# Altium schematic sheet Microcontroller.SchDoc
size A2
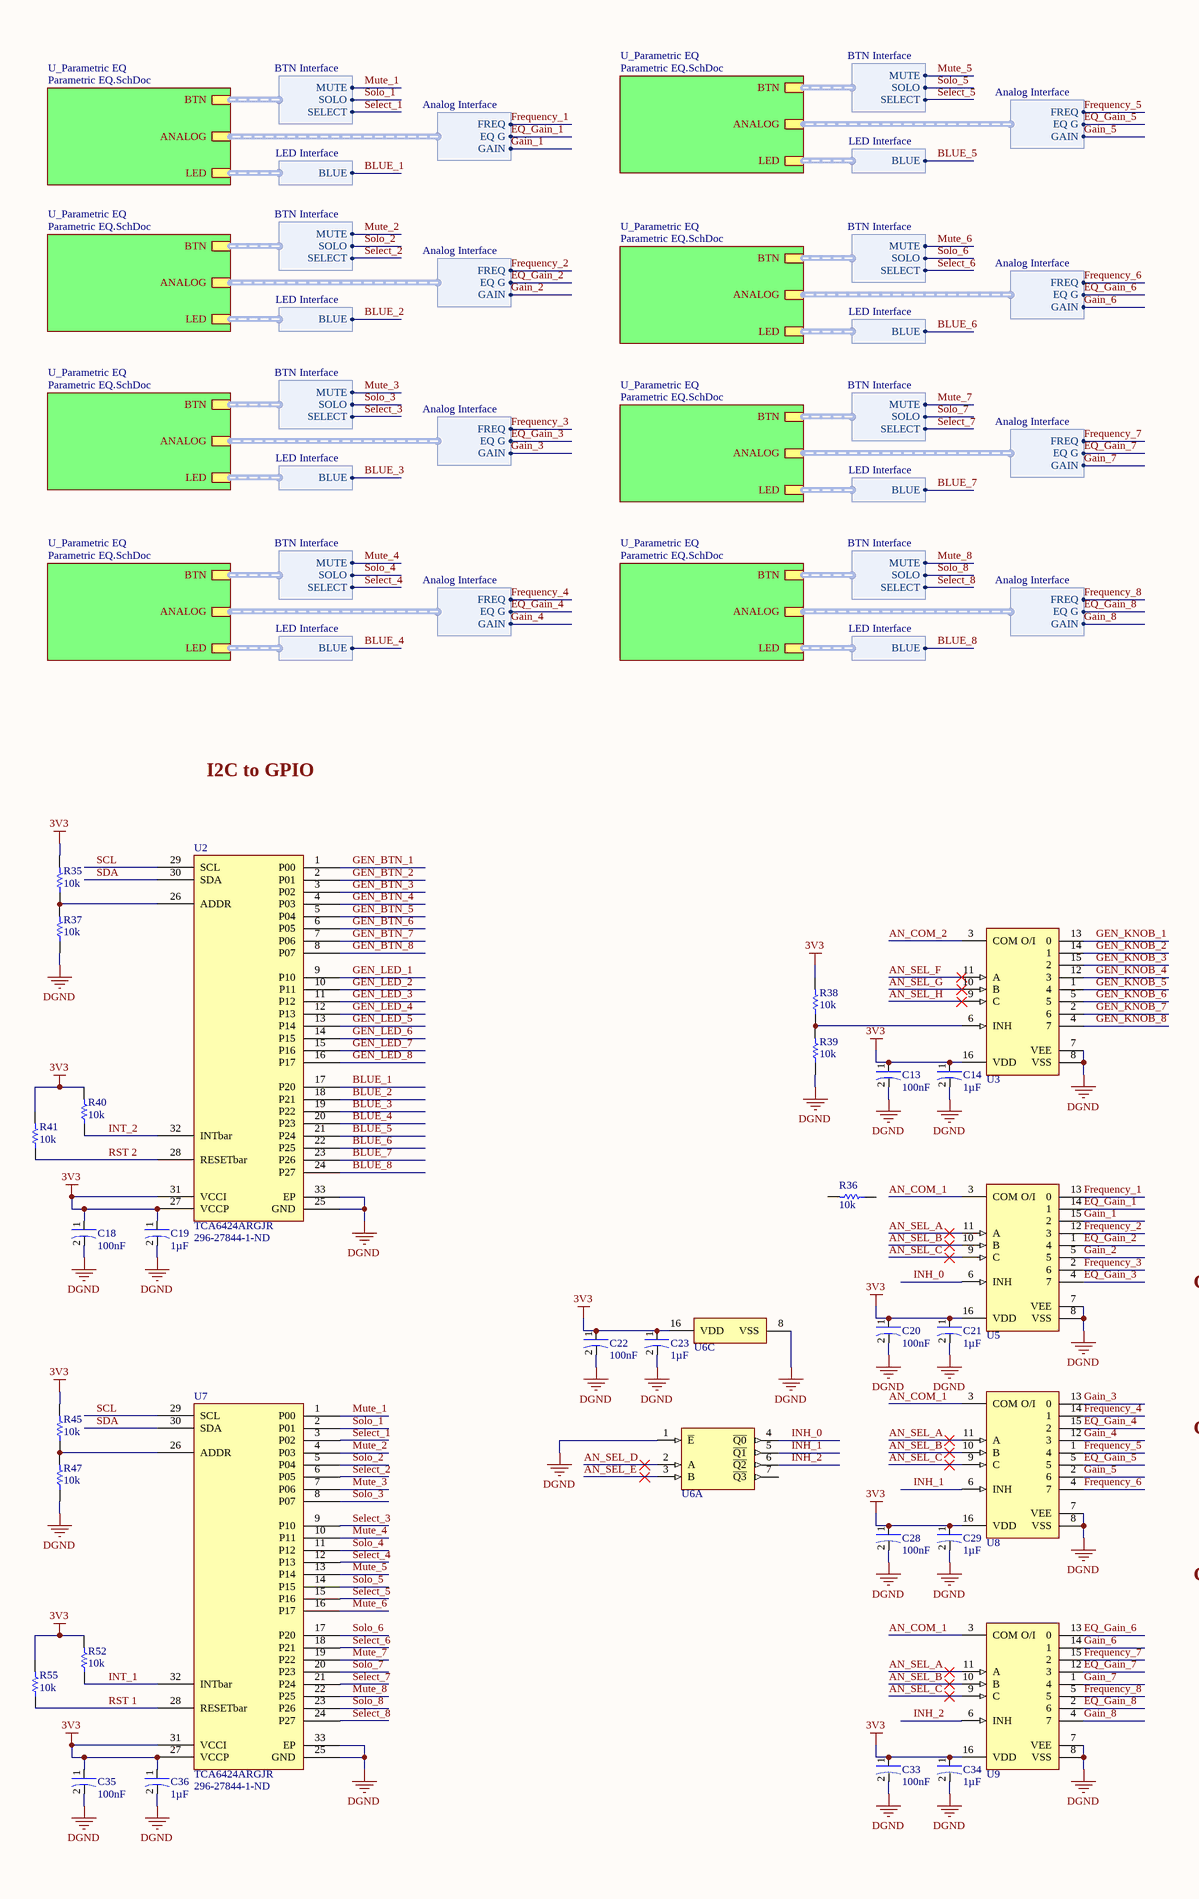
[diagram p0: Microcontroller.SchDoc, left]
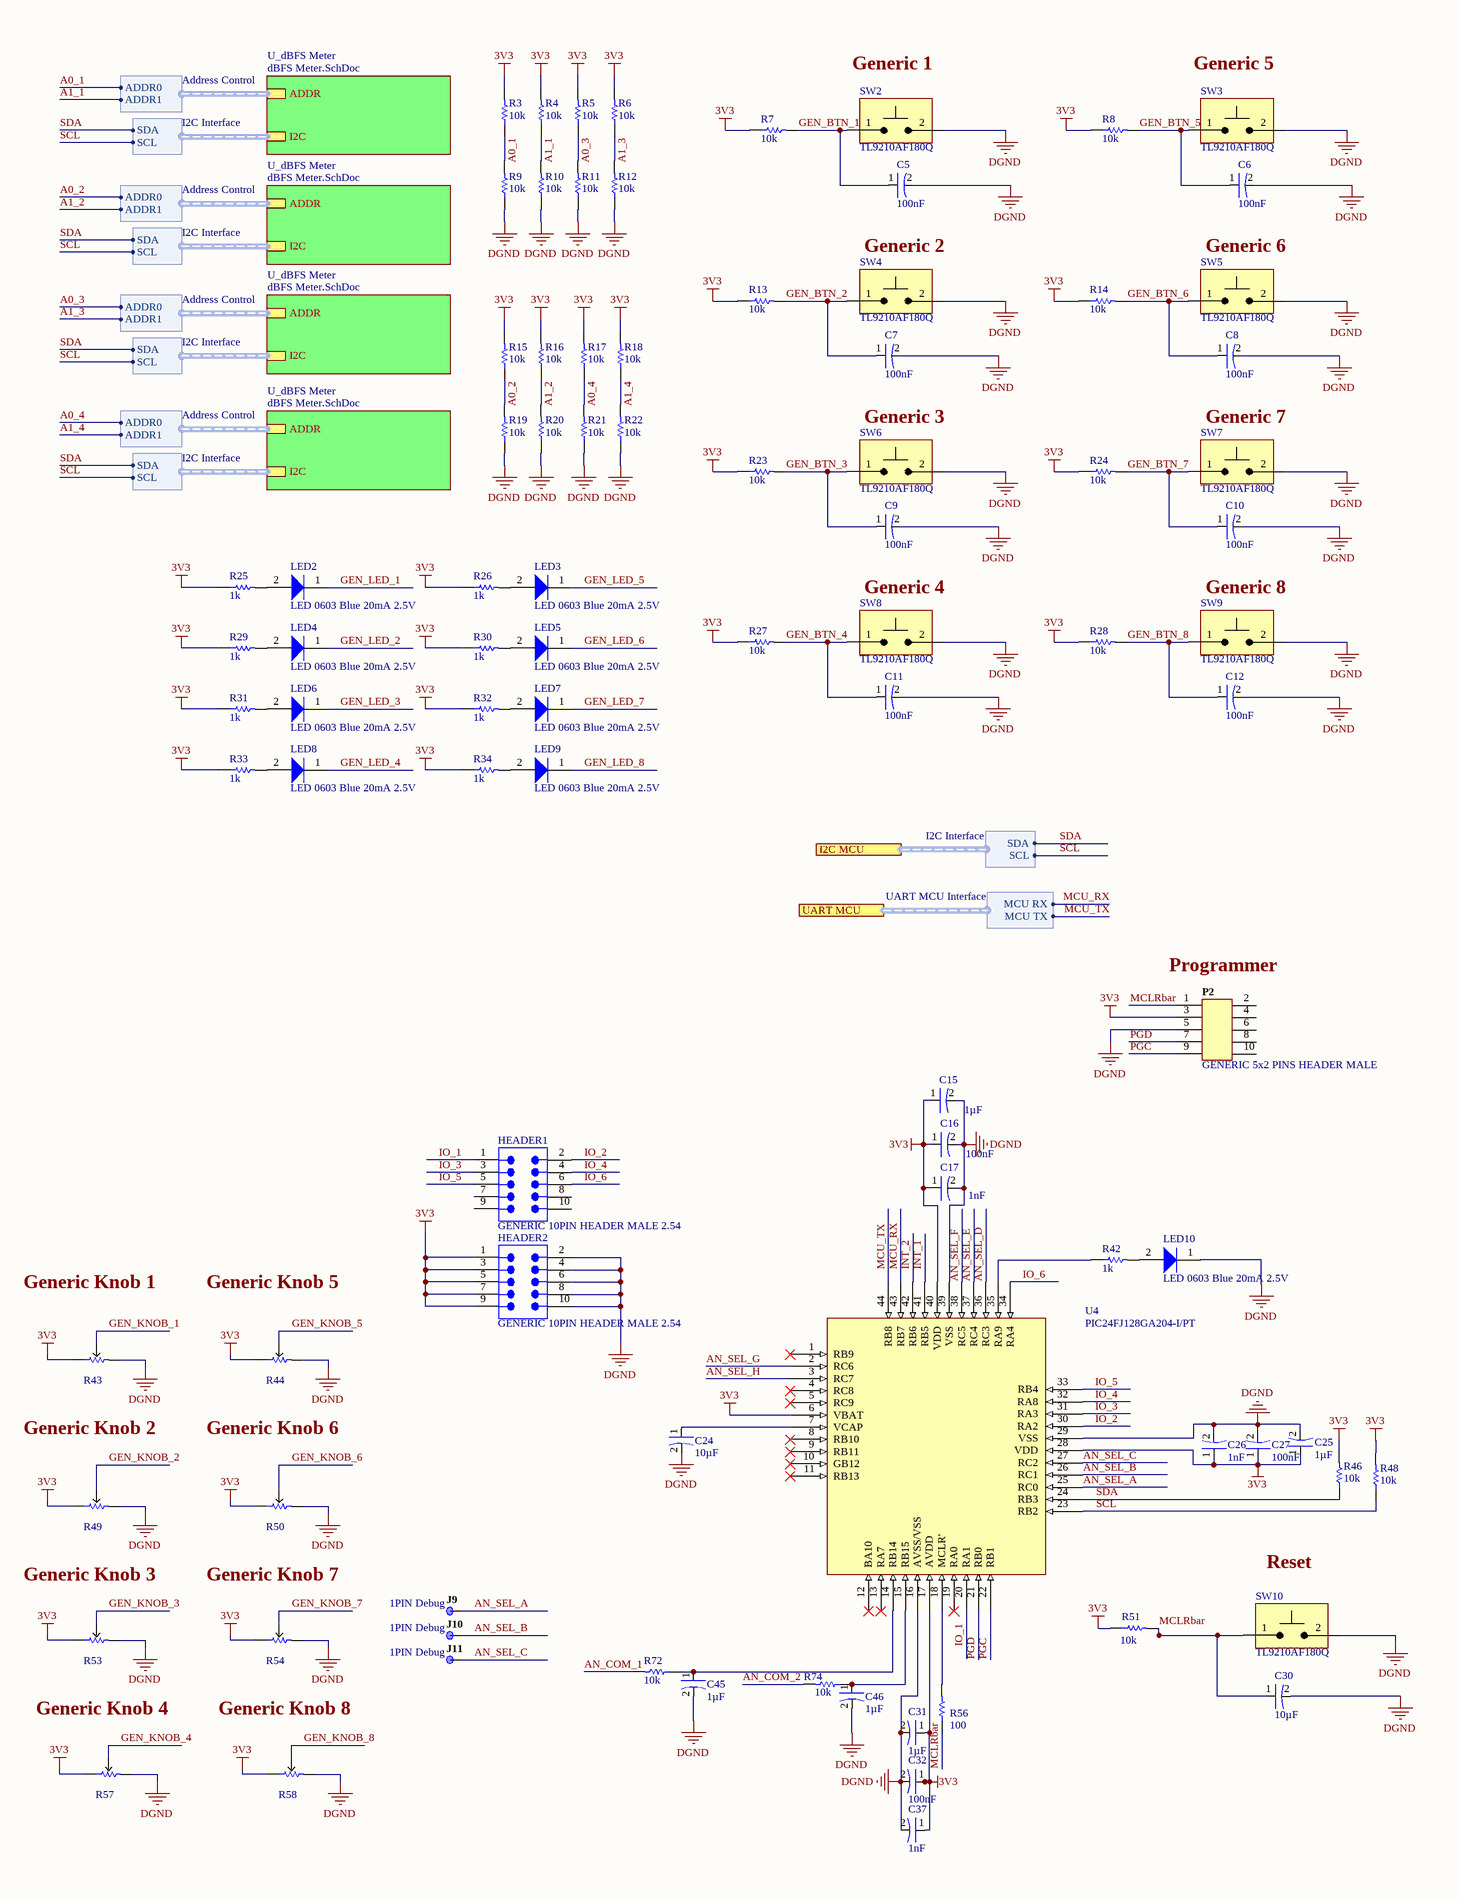
[diagram p1: Microcontroller.SchDoc, right]

## Parts
C5  value 100nF  [0402-M]  (hidden comment: CAP 0.1uF CER 0402 16V X5R 10%)
C6  value 100nF  [0402-M]  (hidden comment: CAP 0.1uF CER 0402 16V X5R 10%)
C7  value 100nF  [0402-M]  (hidden comment: CAP 0.1uF CER 0402 16V X5R 10%)
C8  value 100nF  [0402-M]  (hidden comment: CAP 0.1uF CER 0402 16V X5R 10%)
C9  value 100nF  [0402-M]  (hidden comment: CAP 0.1uF CER 0402 16V X5R 10%)
C10  value 100nF  [0402-M]  (hidden comment: CAP 0.1uF CER 0402 16V X5R 10%)
C11  value 100nF  [0402-M]  (hidden comment: CAP 0.1uF CER 0402 16V X5R 10%)
C12  value 100nF  [0402-M]  (hidden comment: CAP 0.1uF CER 0402 16V X5R 10%)
C13  value 100nF  [0805-M]  (hidden comment: CAP 0.1uF CER 0805 50V  X7R 5%)
C14  value 1µF  [0805-M]  (hidden comment: CAP 1uF CER 0805 25V C0G 10%)
C15  value 1µF  [0805-M]  (hidden comment: CAP 1uF CER 0805 25V C0G 10%)
C16  value 100nF  [0805-M]  (hidden comment: CAP 0.1uF CER 0805 50V  X7R 5%)
C17  value 1nF  [0805-M]  (hidden comment: CAP 1nF CER 0805 25V X7R 5%)
C18  value 100nF  [0805-M]  (hidden comment: CAP 0.1uF CER 0805 50V  X7R 5%)
C19  value 1µF  [0805-M]  (hidden comment: CAP 1uF CER 0805 25V C0G 10%)
C20  value 100nF  [0805-M]  (hidden comment: CAP 0.1uF CER 0805 50V  X7R 5%)
C21  value 1µF  [0805-M]  (hidden comment: CAP 1uF CER 0805 25V C0G 10%)
C22  value 100nF  [0805-M]  (hidden comment: CAP 0.1uF CER 0805 50V  X7R 5%)
C23  value 1µF  [0805-M]  (hidden comment: CAP 1uF CER 0805 25V C0G 10%)
C24  value 10µF  [0805-M]  (hidden comment: CAP 10uF CER 0805 25V X5R 10%)
C25  value 1µF  [0805-M]  (hidden comment: CAP 1uF CER 0805 25V C0G 10%)
C26  value 1nF  [0805-M]  (hidden comment: CAP 1nF CER 0805 25V X7R 5%)
C27  value 100nF  [0805-M]  (hidden comment: CAP 0.1uF CER 0805 50V  X7R 5%)
C28  value 100nF  [0805-M]  (hidden comment: CAP 0.1uF CER 0805 50V  X7R 5%)
C29  value 1µF  [0805-M]  (hidden comment: CAP 1uF CER 0805 25V C0G 10%)
C30  value 10µF  [0402-M]  (hidden comment: CAP 10uF CER 0402 6.3V X5R 20%)
C31  value 1µF  [0805-M]  (hidden comment: CAP 1uF CER 0805 25V C0G 10%)
C32  value 100nF  [0805-M]  (hidden comment: CAP 0.1uF CER 0805 50V  X7R 5%)
C33  value 100nF  [0805-M]  (hidden comment: CAP 0.1uF CER 0805 50V  X7R 5%)
C34  value 1µF  [0805-M]  (hidden comment: CAP 1uF CER 0805 25V C0G 10%)
C35  value 100nF  [0805-M]  (hidden comment: CAP 0.1uF CER 0805 50V  X7R 5%)
C36  value 1µF  [0805-M]  (hidden comment: CAP 1uF CER 0805 25V C0G 10%)
C37  value 1nF  [0805-M]  (hidden comment: CAP 1nF CER 0805 25V X7R 5%)
C45  value 1µF  [0402-M]  (hidden comment: CAP 1uF CER 0402 6.3V X5R 10%)
C46  value 1µF  [0402-M]  (hidden comment: CAP 1uF CER 0402 6.3V X5R 10%)
HEADER1  GENERIC 10PIN HEADER MALE 2.54  [GENERIC 10Pin Header Male 2.54mm]
HEADER2  GENERIC 10PIN HEADER MALE 2.54  [GENERIC 10Pin Header Male 2.54mm]
J9  1PIN Debug  [1 Pin Debug Port 0.9mm]
J10  1PIN Debug  [1 Pin Debug Port 0.9mm]
J11  1PIN Debug  [1 Pin Debug Port 0.9mm]
LED2  LED 0603 Blue 20mA 2.5V  [VAOL-S6SB4]
LED3  LED 0603 Blue 20mA 2.5V  [VAOL-S6SB4]
LED4  LED 0603 Blue 20mA 2.5V  [VAOL-S6SB4]
LED5  LED 0603 Blue 20mA 2.5V  [VAOL-S6SB4]
LED6  LED 0603 Blue 20mA 2.5V  [VAOL-S6SB4]
LED7  LED 0603 Blue 20mA 2.5V  [VAOL-S6SB4]
LED8  LED 0603 Blue 20mA 2.5V  [VAOL-S6SB4]
LED9  LED 0603 Blue 20mA 2.5V  [VAOL-S6SB4]
LED10  LED 0603 Blue 20mA 2.5V  [VAOL-S6SB4]
P2  GENERIC 5x2 PINS HEADER MALE  [GENERIC 5PIN 2ROW HEADER 0]
R3  value 10k  [0402-M]  (hidden comment: RES 10k 0402 63mW 5%)
R4  value 10k  [0402-M]  (hidden comment: RES 10k 0402 63mW 5%)
R5  value 10k  [0402-M]  (hidden comment: RES 10k 0402 63mW 5%)
R6  value 10k  [0402-M]  (hidden comment: RES 10k 0402 63mW 5%)
R7  value 10k  [0402-M]  (hidden comment: RES 10k 0402 63mW 5%)
R8  value 10k  [0402-M]  (hidden comment: RES 10k 0402 63mW 5%)
R9  value 10k  [0402-M]  (hidden comment: RES 10k 0402 63mW 5%)
R10  value 10k  [0402-M]  (hidden comment: RES 10k 0402 63mW 5%)
R11  value 10k  [0402-M]  (hidden comment: RES 10k 0402 63mW 5%)
R12  value 10k  [0402-M]  (hidden comment: RES 10k 0402 63mW 5%)
R13  value 10k  [0402-M]  (hidden comment: RES 10k 0402 63mW 5%)
R14  value 10k  [0402-M]  (hidden comment: RES 10k 0402 63mW 5%)
R15  value 10k  [0402-M]  (hidden comment: RES 10k 0402 63mW 5%)
R16  value 10k  [0402-M]  (hidden comment: RES 10k 0402 63mW 5%)
R17  value 10k  [0402-M]  (hidden comment: RES 10k 0402 63mW 5%)
R18  value 10k  [0402-M]  (hidden comment: RES 10k 0402 63mW 5%)
R19  value 10k  [0402-M]  (hidden comment: RES 10k 0402 63mW 5%)
R20  value 10k  [0402-M]  (hidden comment: RES 10k 0402 63mW 5%)
R21  value 10k  [0402-M]  (hidden comment: RES 10k 0402 63mW 5%)
R22  value 10k  [0402-M]  (hidden comment: RES 10k 0402 63mW 5%)
R23  value 10k  [0402-M]  (hidden comment: RES 10k 0402 63mW 5%)
R24  value 10k  [0402-M]  (hidden comment: RES 10k 0402 63mW 5%)
R25  value 1k  [0402-M]  (hidden comment: RES 1k 0402 63mW 1%)
R26  value 1k  [0402-M]  (hidden comment: RES 1k 0402 63mW 1%)
R27  value 10k  [0402-M]  (hidden comment: RES 10k 0402 63mW 5%)
R28  value 10k  [0402-M]  (hidden comment: RES 10k 0402 63mW 5%)
R29  value 1k  [0402-M]  (hidden comment: RES 1k 0402 63mW 1%)
R30  value 1k  [0402-M]  (hidden comment: RES 1k 0402 63mW 1%)
R31  value 1k  [0402-M]  (hidden comment: RES 1k 0402 63mW 1%)
R32  value 1k  [0402-M]  (hidden comment: RES 1k 0402 63mW 1%)
R33  value 1k  [0402-M]  (hidden comment: RES 1k 0402 63mW 1%)
R34  value 1k  [0402-M]  (hidden comment: RES 1k 0402 63mW 1%)
R35  value 10k  [0805-M]  (hidden comment: RES 10k 0805 125mW 1%)
R36  value 10k  [0402-M]  (hidden comment: RES 10k 0402 63mW 5%)
R37  value 10k  [0805-M]  (hidden comment: RES 10k 0805 125mW 1%)
R38  value 10k  [0805-M]  (hidden comment: RES 10k 0805 125mW 1%)
R39  value 10k  [0805-M]  (hidden comment: RES 10k 0805 125mW 1%)
R40  value 10k  [0805-M]  (hidden comment: RES 10k 0805 125mW 1%)
R41  value 10k  [0805-M]  (hidden comment: RES 10k 0805 125mW 1%)
R42  value 1k  [0402-M]  (hidden comment: RES 1k 0402 63mW 1%)
R43  P120PK-Y25BR10K  [P120PK-Y25BR10K-Footprint-1]  (value not drawn)
R44  P120PK-Y25BR10K  [P120PK-Y25BR10K-Footprint-1]  (value not drawn)
R45  value 10k  [0805-M]  (hidden comment: RES 10k 0805 125mW 1%)
R46  value 10k  [0805-M]  (hidden comment: RES 10k 0805 125mW 1%)
R47  value 10k  [0805-M]  (hidden comment: RES 10k 0805 125mW 1%)
R48  value 10k  [0805-M]  (hidden comment: RES 10k 0805 125mW 1%)
R49  P120PK-Y25BR10K  [P120PK-Y25BR10K-Footprint-1]  (value not drawn)
R50  P120PK-Y25BR10K  [P120PK-Y25BR10K-Footprint-1]  (value not drawn)
R51  value 10k  [0402-M]  (hidden comment: RES 10k 0402 63mW 5%)
R52  value 10k  [0805-M]  (hidden comment: RES 10k 0805 125mW 1%)
R53  P120PK-Y25BR10K  [P120PK-Y25BR10K-Footprint-1]  (value not drawn)
R54  P120PK-Y25BR10K  [P120PK-Y25BR10K-Footprint-1]  (value not drawn)
R55  value 10k  [0805-M]  (hidden comment: RES 10k 0805 125mW 1%)
R56  value 100  [0805-L]  (hidden comment: RES 100 0805 125mW 1%)
R57  P120PK-Y25BR10K  [P120PK-Y25BR10K-Footprint-1]  (value not drawn)
R58  P120PK-Y25BR10K  [P120PK-Y25BR10K-Footprint-1]  (value not drawn)
R72  value 10k  [0402-M]  (hidden comment: RES 10k 0402 63mW 5%)
R74  value 10k  [0402-M]  (hidden comment: RES 10k 0402 63mW 5%)
SW2  TL9210AF180Q  [TL9210]
SW3  TL9210AF180Q  [TL9210]
SW4  TL9210AF180Q  [TL9210]
SW5  TL9210AF180Q  [TL9210]
SW6  TL9210AF180Q  [TL9210]
SW7  TL9210AF180Q  [TL9210]
SW8  TL9210AF180Q  [TL9210]
SW9  TL9210AF180Q  [TL9210]
SW10  TL9210AF180Q  [TL9210]
U2  TCA6424ARGJR  Supplier Part Number 1: 296-27844-1-ND  [TCA6424ARGJR]
U3  CD4051BM  [D0016A_M]  (value not drawn)
U4  PIC24FJ128GA204-I/PT  [CQFP80P1415X1415X120-44N]
U5  CD4051BM  [D0016A_M]  (value not drawn)
U6  CD4556BM96  [D0016A_M]  (value not drawn)  (parts A,C of 3)
U7  TCA6424ARGJR  Supplier Part Number 1: 296-27844-1-ND  [TCA6424ARGJR]
U8  CD4051BM  [D0016A_M]  (value not drawn)
U9  CD4051BM  [D0016A_M]  (value not drawn)

## Sub-sheets
U_dBFS Meter = dBFS Meter.SchDoc: ADDR (harness Address Control), I2C (harness I2C Interface)
U_dBFS Meter = dBFS Meter.SchDoc: ADDR (harness Address Control), I2C (harness I2C Interface)
U_dBFS Meter = dBFS Meter.SchDoc: ADDR (harness Address Control), I2C (harness I2C Interface)
U_dBFS Meter = dBFS Meter.SchDoc: ADDR (harness Address Control), I2C (harness I2C Interface)
U_Parametric EQ = Parametric EQ.SchDoc: BTN (harness BTN Interface), ANALOG (harness Analog Interface), LED (harness LED Interface)
U_Parametric EQ = Parametric EQ.SchDoc: BTN (harness BTN Interface), ANALOG (harness Analog Interface), LED (harness LED Interface)
U_Parametric EQ = Parametric EQ.SchDoc: BTN (harness BTN Interface), ANALOG (harness Analog Interface), LED (harness LED Interface)
U_Parametric EQ = Parametric EQ.SchDoc: BTN (harness BTN Interface), ANALOG (harness Analog Interface), LED (harness LED Interface)
U_Parametric EQ = Parametric EQ.SchDoc: BTN (harness BTN Interface), ANALOG (harness Analog Interface), LED (harness LED Interface)
U_Parametric EQ = Parametric EQ.SchDoc: BTN (harness BTN Interface), ANALOG (harness Analog Interface), LED (harness LED Interface)
U_Parametric EQ = Parametric EQ.SchDoc: BTN (harness BTN Interface), ANALOG (harness Analog Interface), LED (harness LED Interface)
U_Parametric EQ = Parametric EQ.SchDoc: BTN (harness BTN Interface), ANALOG (harness Analog Interface), LED (harness LED Interface)

## Ports
I2C MCU (harness I2C Interface), UART MCU (harness UART MCU Interface)

## Harnesses
UART MCU Interface: MCU RX, MCU TX
BTN Interface: MUTE, SOLO, SELECT
Analog Interface: FREQ, EQ G, GAIN
I2C Interface: SDA, SCL
Address Control: ADDR0, ADDR1
LED Interface: BLUE

## Nets
3V3: C13.1(Anode) C14.1(Anode) C15.1(Anode) C16.1(Anode) C17.1(Anode) C18.1(Anode) C19.1(Anode) C20.1(Anode) C21.1(Anode) C22.1(Anode) C23.1(Anode) C25.1(Anode) C26.1(Anode) C27.1(Anode) C28.1(Anode) C29.1(Anode) C31.1(Anode) C32.1(Anode) C33.1(Anode) C34.1(Anode) C35.1(Anode) C36.1(Anode) C37.1(Anode) HEADER2.1 HEADER2.3 HEADER2.5 HEADER2.7 HEADER2.9 P2.3 R3.2 R4.2 R5.2 R6.2 R7.1 R8.1 R13.1 R14.1 R15.2 R16.2 R17.2 R18.2 R23.1 R24.1 R25.1 R26.1 R27.1 R28.1 R29.1 R30.1 R31.1 R32.1 R33.1 R34.1 R35.2 R38.2 R40.2 R41.2 R43.1 R44.1 R45.2 R46.2 R48.2 R49.1 R50.1 R51.1 R52.2 R53.1 R54.1 R55.2 R57.1 R58.1 U2.27(VCCP) U2.31(VCCI) U3.16(VDD) U4.6(VBAT) U4.17(AVDD) U4.28(VDD) U4.40(VDD) U5.16(VDD) U6.16(VDD) U7.27(VCCP) U7.31(VCCI) U8.16(VDD) U9.16(VDD)
DGND: C5.2(Cathode) C6.2(Cathode) C7.2(Cathode) C8.2(Cathode) C9.2(Cathode) C10.2(Cathode) C11.2(Cathode) C12.2(Cathode) C13.2(Cathode) C14.2(Cathode) C15.2(Cathode) C16.2(Cathode) C17.2(Cathode) C18.2(Cathode) C19.2(Cathode) C20.2(Cathode) C21.2(Cathode) C22.2(Cathode) C23.2(Cathode) C24.2(Cathode) C25.2(Cathode) C26.2(Cathode) C27.2(Cathode) C28.2(Cathode) C29.2(Cathode) C30.2(Cathode) C31.2(Cathode) C32.2(Cathode) C33.2(Cathode) C34.2(Cathode) C35.2(Cathode) C36.2(Cathode) C37.2(Cathode) C45.2(Cathode) C46.2(Cathode) HEADER2.2 HEADER2.4 HEADER2.6 HEADER2.8 HEADER2.10 LED10.1 P2.5 R9.1 R10.1 R11.1 R12.1 R19.1 R20.1 R21.1 R22.1 R37.1 R39.1 R43.3 R44.3 R47.1 R49.3 R50.3 R53.3 R54.3 R57.3 R58.3 SW2.2 SW3.2 SW4.2 SW5.2 SW6.2 SW7.2 SW8.2 SW9.2 SW10.2 U2.25(GND) U2.33(EP) U3.7(VEE) U3.8(VSS) U4.16(AVSS/VSS) U4.29(VSS) U4.39(VSS) U5.7(VEE) U5.8(VSS) U6.1(~{E}) U6.8(VSS) U7.25(GND) U7.33(EP) U8.7(VEE) U8.8(VSS) U9.7(VEE) U9.8(VSS)
A0_1: R3.1 R9.2 ; sheet U_dBFS Meter/ADDR.ADDR0
A0_2: R15.1 R19.2 ; sheet U_dBFS Meter/ADDR.ADDR0
A0_3: R5.1 R11.2 ; sheet U_dBFS Meter/ADDR.ADDR0
A0_4: R17.1 R21.2 ; sheet U_dBFS Meter/ADDR.ADDR0
A1_1: R4.1 R10.2 ; sheet U_dBFS Meter/ADDR.ADDR1
A1_2: R16.1 R20.2 ; sheet U_dBFS Meter/ADDR.ADDR1
A1_3: R6.1 R12.2 ; sheet U_dBFS Meter/ADDR.ADDR1
A1_4: R18.1 R22.2 ; sheet U_dBFS Meter/ADDR.ADDR1
AN_COM_1: R72.2 U5.3(COM_O/I) U8.3(COM_O/I) U9.3(COM_O/I)
AN_COM_2: R74.2 U3.3(COM_O/I)
AN_SEL_A: J9.1 U4.25(RC0) U5.11(A) U8.11(A) U9.11(A)
AN_SEL_B: J10.1 U4.26(RC1) U5.10(B) U8.10(B) U9.10(B)
AN_SEL_C: J11.1 U4.27(RC2) U5.9(C) U8.9(C) U9.9(C)
AN_SEL_D: U4.36(RC3) U6.2(A)
AN_SEL_E: U4.37(RC4) U6.3(B)
AN_SEL_F: U3.11(A) U4.38(RC5)
AN_SEL_G: U3.10(B) U4.2(RC6)
AN_SEL_H: U3.9(C) U4.3(RC7)
BLUE_1: U2.17(P20) ; sheet U_Parametric EQ/LED.BLUE
BLUE_2: U2.18(P21) ; sheet U_Parametric EQ/LED.BLUE
BLUE_3: U2.19(P22) ; sheet U_Parametric EQ/LED.BLUE
BLUE_4: U2.20(P23) ; sheet U_Parametric EQ/LED.BLUE
BLUE_5: U2.21(P24) ; sheet U_Parametric EQ/LED.BLUE
BLUE_6: U2.22(P25) ; sheet U_Parametric EQ/LED.BLUE
BLUE_7: U2.23(P26) ; sheet U_Parametric EQ/LED.BLUE
BLUE_8: U2.24(P27) ; sheet U_Parametric EQ/LED.BLUE
EQ_Gain_1: U5.14(1) ; sheet U_Parametric EQ/ANALOG.EQ G
EQ_Gain_2: U5.1(4) ; sheet U_Parametric EQ/ANALOG.EQ G
EQ_Gain_3: U5.4(7) ; sheet U_Parametric EQ/ANALOG.EQ G
EQ_Gain_4: U8.15(2) ; sheet U_Parametric EQ/ANALOG.EQ G
EQ_Gain_5: U8.5 ; sheet U_Parametric EQ/ANALOG.EQ G
EQ_Gain_6: U9.13(0) ; sheet U_Parametric EQ/ANALOG.EQ G
EQ_Gain_7: U9.12(3) ; sheet U_Parametric EQ/ANALOG.EQ G
EQ_Gain_8: U9.2(6) ; sheet U_Parametric EQ/ANALOG.EQ G
Frequency_1: U5.13(0) ; sheet U_Parametric EQ/ANALOG.FREQ
Frequency_2: U5.12(3) ; sheet U_Parametric EQ/ANALOG.FREQ
Frequency_3: U5.2(6) ; sheet U_Parametric EQ/ANALOG.FREQ
Frequency_4: U8.14(1) ; sheet U_Parametric EQ/ANALOG.FREQ
Frequency_5: U8.1(4) ; sheet U_Parametric EQ/ANALOG.FREQ
Frequency_6: U8.4(7) ; sheet U_Parametric EQ/ANALOG.FREQ
Frequency_7: U9.15(2) ; sheet U_Parametric EQ/ANALOG.FREQ
Frequency_8: U9.5 ; sheet U_Parametric EQ/ANALOG.FREQ
Gain_1: U5.15(2) ; sheet U_Parametric EQ/ANALOG.GAIN
Gain_2: U5.5 ; sheet U_Parametric EQ/ANALOG.GAIN
Gain_3: U8.13(0) ; sheet U_Parametric EQ/ANALOG.GAIN
Gain_4: U8.12(3) ; sheet U_Parametric EQ/ANALOG.GAIN
Gain_5: U8.2(6) ; sheet U_Parametric EQ/ANALOG.GAIN
Gain_6: U9.14(1) ; sheet U_Parametric EQ/ANALOG.GAIN
Gain_7: U9.1(4) ; sheet U_Parametric EQ/ANALOG.GAIN
Gain_8: U9.4(7) ; sheet U_Parametric EQ/ANALOG.GAIN
GEN_BTN_1: C5.1(Anode) R7.2 SW2.1 U2.1(P00)
GEN_BTN_2: C7.1(Anode) R13.2 SW4.1 U2.2(P01)
GEN_BTN_3: C9.1(Anode) R23.2 SW6.1 U2.3(P02)
GEN_BTN_4: C11.1(Anode) R27.2 SW8.1 U2.4(P03)
GEN_BTN_5: C6.1(Anode) R8.2 SW3.1 U2.5(P04)
GEN_BTN_6: C8.1(Anode) R14.2 SW5.1 U2.6(P05)
GEN_BTN_7: C10.1(Anode) R24.2 SW7.1 U2.7(P06)
GEN_BTN_8: C12.1(Anode) R28.2 SW9.1 U2.8(P07)
GEN_KNOB_1: R43.2 U3.13(0)
GEN_KNOB_2: R49.2 U3.14(1)
GEN_KNOB_3: R53.2 U3.15(2)
GEN_KNOB_4: R57.2 U3.12(3)
GEN_KNOB_5: R44.2 U3.1(4)
GEN_KNOB_6: R50.2 U3.5
GEN_KNOB_7: R54.2 U3.2(6)
GEN_KNOB_8: R58.2 U3.4(7)
GEN_LED_1: LED2.1 U2.9(P10)
GEN_LED_2: LED4.1 U2.10(P11)
GEN_LED_3: LED6.1 U2.11(P12)
GEN_LED_4: LED8.1 U2.12(P13)
GEN_LED_5: LED3.1 U2.13(P14)
GEN_LED_6: LED5.1 U2.14(P15)
GEN_LED_7: LED7.1 U2.15(P16)
GEN_LED_8: LED9.1 U2.16(P17)
INH_0: U5.6(INH) U6.4(~{Q0})
INH_1: U6.5(~{Q1}) U8.6(INH)
INH_2: U6.6(~{Q2}) U9.6(INH)
INT_1: R52.1 U4.41(RB5) U7.32(INTbar)
INT_2: R40.1 U2.32(INTbar) U4.42(RB6)
IO_1: HEADER1.1 U4.20(RA1)
IO_2: HEADER1.2 U4.30(RA2)
IO_3: HEADER1.3 U4.31(RA3)
IO_4: HEADER1.4 U4.32(RA8)
IO_5: HEADER1.5 U4.33(RB4)
IO_6: HEADER1.6 U4.34(RA4)
MCLRbar: C30.1(Anode) P2.1 R51.2 R56.1 SW10.1
MCU_RX: U4.43(RB7) ; port UART MCU.MCU RX
MCU_TX: U4.44(RB8) ; port UART MCU.MCU TX
Mute_1: U7.1(P00) ; sheet U_Parametric EQ/BTN.MUTE
Mute_2: U7.4(P03) ; sheet U_Parametric EQ/BTN.MUTE
Mute_3: U7.7(P06) ; sheet U_Parametric EQ/BTN.MUTE
Mute_4: U7.10(P11) ; sheet U_Parametric EQ/BTN.MUTE
Mute_5: U7.13(P14) ; sheet U_Parametric EQ/BTN.MUTE
Mute_6: U7.16(P17) ; sheet U_Parametric EQ/BTN.MUTE
Mute_7: U7.19(P22) ; sheet U_Parametric EQ/BTN.MUTE
Mute_8: U7.22(P25) ; sheet U_Parametric EQ/BTN.MUTE
PGC: P2.9 U4.22(RB1)
PGD: P2.7 U4.21(RB0)
RST 1: R55.1 U7.28(RESETbar)
RST 2: R41.1 U2.28(RESETbar)
SCL: R48.1 U2.29(SCL) U4.23(RB2) U7.29(SCL) ; sheet U_dBFS Meter/I2C.SCL, port I2C MCU.SCL
SDA: R46.1 U2.30(SDA) U4.24(RB3) U7.30(SDA) ; sheet U_dBFS Meter/I2C.SDA, port I2C MCU.SDA
Select_1: U7.3(P02) ; sheet U_Parametric EQ/BTN.SELECT
Select_2: U7.6(P05) ; sheet U_Parametric EQ/BTN.SELECT
Select_3: U7.9(P10) ; sheet U_Parametric EQ/BTN.SELECT
Select_4: U7.12(P13) ; sheet U_Parametric EQ/BTN.SELECT
Select_5: U7.15(P16) ; sheet U_Parametric EQ/BTN.SELECT
Select_6: U7.18(P21) ; sheet U_Parametric EQ/BTN.SELECT
Select_7: U7.21(P24) ; sheet U_Parametric EQ/BTN.SELECT
Select_8: U7.24(P27) ; sheet U_Parametric EQ/BTN.SELECT
Solo_1: U7.2(P01) ; sheet U_Parametric EQ/BTN.SOLO
Solo_2: U7.5(P04) ; sheet U_Parametric EQ/BTN.SOLO
Solo_3: U7.8(P07) ; sheet U_Parametric EQ/BTN.SOLO
Solo_4: U7.11(P12) ; sheet U_Parametric EQ/BTN.SOLO
Solo_5: U7.14(P15) ; sheet U_Parametric EQ/BTN.SOLO
Solo_6: U7.17(P20) ; sheet U_Parametric EQ/BTN.SOLO
Solo_7: U7.20(P23) ; sheet U_Parametric EQ/BTN.SOLO
Solo_8: U7.23(P26) ; sheet U_Parametric EQ/BTN.SOLO
NetC24_1: C24.1(Anode) U4.7(VCAP)
NetC45_1: C45.1(Anode) R72.1 U4.14(RB14)
NetC46_1: C46.1(Anode) R74.1 U4.15(RB15)
NetLED2_2: LED2.2 R25.2
NetLED3_2: LED3.2 R26.2
NetLED4_2: LED4.2 R29.2
NetLED5_2: LED5.2 R30.2
NetLED6_2: LED6.2 R31.2
NetLED7_2: LED7.2 R32.2
NetLED8_2: LED8.2 R33.2
NetLED9_2: LED9.2 R34.2
NetLED10_2: LED10.2 R42.2
NetR35_1: R35.1 R37.2 U2.26(ADDR)
NetR38_1: R38.1 R39.2 U3.6(INH)
NetR42_1: R42.1 U4.35(RA9)
NetR45_1: R45.1 R47.2 U7.26(ADDR)
NetR56_2: R56.2 U4.18(MCLR')

Not connected (* = marked no-connect by the designer): HEADER1 7 8 9 10; P2 2 4 6 8 10; R36 1 2; U4 1(RB9)* 4(RC8)* 5(RC9)* 8(RB10)* 9(RB11)* 10(GB12)* 11(RB13)* 12(BA10)* 13(RA7)* 19(RA0)*; U6 7(~{Q3})

## Notes on the sheet
- Generic 1
- Generic 5
- Generic 2
- Generic 6
- Generic 3
- Generic 7
- Generic 4
- Generic 8
- I2C to GPIO
- (near P2) Programmer
- Generic Knob 1
- Generic Knob 5
- Generic Knob 2
- Generic Knob 6
- Generic Knob 3
- Generic Knob 7
- Reset
- Generic Knob 4
- Generic Knob 8

## Library data of the parts
C5-C12 = CAP 0.1uF CER 0402 16V X5R 10%-2: CAP-0.1uF-CER-0402-16V-X5R-10%; Manufacturer: Generic; Bin: CAP1-M1; Type: SMD; Source: Capacitor Library.SchLib; Status: Active; Design Item ID: CAP 0.1uF CER 0402 16V X5R 10%; Supplier 1: Mouser; Supplier Part Number 1: 810-CGA2B2X5R1C104KA; Case/Package: 0402
C13 C16 C18 C20 C22 C27 C28 C32 C33 C35 = CAP 0.1uF CER 0805 50V  X7R 5%-2: CAP-0.1uF-CER-0805-50V- X7R-5%; Manufacturer: Generic; Bin: F1-C6-4; Type: SMD; Design Item ID: CAP 0.1uF CER 0805 50V  X7R 5%; Supplier 1: Mouser; Datasheet: http://www.kemet.com/Lists/ProductCatalog/Attachments/53/KEM_C1002_X7R_SMD.pdf; Source: Capacitor Library.SchLib; Case/Package: 0805; Status: Active; Supplier Part Number 1: 80-C0805C104J3R
C14 C15 C19 C21 C23 C25 C29 C31 C34 C36 = CAP 1uF CER 0805 25V C0G 10%-2: Manufacturer: Generic; Type: SMD; Bin: N; Source: Capacitor Library.SchLib; Design Item ID: CAP 1uF CER 0805 25V C0G 10%; Supplier 1: Mouser; Supplier Part Number 1: 810-C2012X5R1E105K; Status: Active; Case/Package: 0805
C17 C26 C37 = CAP 1nF CER 0805 25V X7R 5%-2: Manufacturer: Generic; Bin: N; Type: SMD; Source: Capacitor Library.SchLib; Datasheet: http://www.mouser.com/ds/2/212/KEM_C1002_X7R_SMD-357932.pdf; Supplier 1: Mouser; Status: Active; Design Item ID: CAP 1nF CER 0805 25V X7R 5%; Supplier Part Number 1: 77-VJ0805Y102JXXPBC; Case/Package: 0805
C24 = CAP 10uF CER 0805 25V X5R 10%-2: CAP-10uF-CER-0805-25V-X5R-10%; Manufacturer: Generic; Type: SMD; Bin: F1-C1-4; Supplier 1: Mouser; Case/Package: 0805; Source: Capacitor Library.SchLib; Supplier Part Number 1: 80-C0805C106K8P; Status: Active; Design Item ID: CAP 10uF CER 0805 25V X5R 10%
C30 = CAP 10uF CER 0402 6.3V X5R 20%-2: CAP-10uF-CER-0402-6.3V-X5R-20%; Manufacturer: Generic; Type: SMD; Bin: F1-C2-10; Supplier Part Number 1: 80-C0402C106M9P; Source: Capacitor Library.SchLib; Case/Package: 0402; Supplier 1: Mouser; Design Item ID: CAP 10uF CER 0402 6.3V X5R 20%
C45 C46 = CAP 1uF CER 0402 6.3V X5R 10%-2: CAP-1uF-CER-0402-6.3V-X5R-10%; Manufacturer: Generic; Type: SMD; Bin: F1-CM1-04; Supplier 1: Mouser; Status: Active; Design Item ID: CAP 1uF CER 0402 6.3V X5R 10%; Source: Capacitor Library.SchLib; Supplier Part Number 1: 603-CC402KRX5R9BB104; Case/Package: 0402
HEADER1 HEADER2 = GENERIC 10PIN HEADER MALE 2.54-2: CONN MAL TH 10 0Deg HEADER 2.54mm; Bin: B3-J5; Status: Active; Case/Package: 6 PIN; Manufacturer: Generic; Type: TH; Design Item ID: GENERIC 10PIN HEADER MALE 2.54; Source: Connector Library.SchLib
J9-J11 = 1PIN Debug-2: CONN MAL TH 1 0Deg HEADER; Status: NC; Case/Package: 1 PIN; Source: Connector Library.SchLib; Type: N/A; Design Item ID: 1PIN Debug
LED2-LED10 = LED 0603 Blue 20mA 2.5V-1: LED-0603-Blue-20mA-2.5V-STOCK; Manufacturer: Generic; Bin: F2-DM1-4; Type: SMD; Design Item ID: LED 0603 Blue 20mA 2.5V; Supplier 1: Mouser; Supplier Part Number 1: 604-APT1608LVBCD; Status: Active; Case/Package: 0603; Source: Diode Library.SchLib
P2 = GENERIC 5x2 PINS HEADER MALE-2: CONN MAL TH 5x2 0Deg HEADER; Bin: B3-J5; Status: Active; Case/Package: 2 PIN; Source: Connector Library.SchLib; Type: TH; Design Item ID: GENERIC 5x2 PINS HEADER MALE; Manufacturer: Generic
R3-R24 R27 R28 R36 R51 R72 R74 = RES 10k 0402 63mW 5%-1: RES-10k-0402-63mW-5%; Manufacturer: Generic; Bin: F1-R7-9; MAPPING: 1(2,1,11.5k); Design Item ID: RES 10k 0402 63mW 5%; Type: SMD; Status: Active; Case/Package: 0402; Source: Resistor Library.SchLib
R25 R26 R29-R34 R42 = RES 1k 0402 63mW 1%-1: RES-1k-0402-63mW-1%; Manufacturer: Generic; Bin: F1-R3-10; MAPPING: 1(2,1,11.5k); Source: Resistor Library.SchLib; Case/Package: 0402; Type: SMD; Design Item ID: RES 1k 0402 63mW 1%; Status: Active
R35 R37-R41 R45-R48 R52 R55 = RES 10k 0805 125mW 1%-1: RES-10k-0805-125mW-1%; Manufacturer: Generic; MAPPING: 1(2,1,10k); Bin: F1-R12-10; Design Item ID: RES 10k 0805 125mW 1%; Case/Package: 0805; Type: SMD; Status: Active; Source: Resistor Library.SchLib
R43 R44 R49 R50 R53 R54 R57 R58 = CMP-002-00002-1: Potentiometers 12mm 10K ohm; Number of Gangs: 1; Tolerance: 20%; Max Power Dissipation: 50mW; Resistance: 10kR; Actuator Diameter: 0.236inch; Actuator Length: 0.984inch; Termination: PC Pins; Min Operating Temperature: -20°C; Max Operating Temperature: 70°C; Packaging: Tray; Power Rating: 50mW; Number of Turns: 1; Package Quantity: 275; Mount: Through Hole,Snap in; Taper: Linear; Resistor Type: Conductive Plastic,Potentiometer
R56 = RES 100 0805 125mW 1%-1: RES-100-0805-125mW-1%; Manufacturer: Generic; Bin: F1-R11-6; MAPPING: 1(2,1,10k); Status: Active; Case/Package: 0805; Source: Resistor Library.SchLib; Type: SMD; Design Item ID: RES 100 0805 125mW 1%
SW2-SW10 = TL9210AF180Q-2: SWITCH MOM SMD SPST 50MA 12V Soft Tact; Manufacturer: E-Switch; Status: Active; Case/Package: 2 PIN; Type: SMD; Supplier 1: Mouser; Supplier Part Number 1: 612-TL9210AF180Q; Design Item ID: TL9210AF180Q; Source: Switches Library.SchLib
U2 U7 = TCA6424ARGJR: Low-Voltage 24-Bit I2C and SMBus I/O Expander, 24 Outputs, 1.65 to 5.5 V, -40 to 85 degC, 32-pin UQFN (RGJ), Green (RoHS & no Sb/Br); Supplier 1: Digi-Key
U3 U5 U8 U9 = CMP-01301-1: Analog Multiplexer Single 8:1 16-Pin SOIC Tube; Number of Inputs: 8; Operating Supply Current: 80nA; Logic Function: Multiplexer,Demultiplexer; Supply Type: Single,Dual; Propagation Delay: 60ns; Turn-Off Delay Time: 450ns; Min Dual Supply Voltage: 2.5V; Dual Supply Voltage: 5V; Number of Circuits: 1; Max Power Dissipation: 700mW; Turn-On Delay Time: 720ns; Operating Supply Voltage: 18V; Min Supply Voltage: 3V; Bandwidth: 20MHz; Max Supply Voltage: 20V; Max Dual Supply Voltage: 9V; On-State Resistance: 240R; Length: 9.9mm; Package Quantity: 40; Width: 3.91mm; Case/Package: SOIC; Max Operating Temperature: 125°C; Height: 1.58mm; Min Operating Temperature: -55°C; Contact Plating: Gold; Lead Free: Lead Free; Number of Bits: 8; Number of Outputs: 1; Packaging: Rail/Tube; Number of Pins: 16; Number of Channels: 1; Weight: 0.004998oz; REACH SVHC: No SVHC; Radiation Hardening: No; Mount: Surface Mount
U4 = CMP-01295-2: IC MCU 16BIT 128KB FLASH 44TQFP; Manufacturer: Microchip; Bin: NR; Case/Package: 44 TQFP; Supplier Part Number1: NR; Status: NR; Type: SMD; Supplier1: NR
U6 = CMP-01302-1: Decoder/Demultiplexer Dual 2-to-4 16-Pin SOIC T/R; Turn-On Delay Time: 440ns; Number of Input Lines: 1; Min Supply Voltage: 3V; High Level Output Current: 6.8mA; Bandwidth: 8MHz; Number of Bits: 4; Max Supply Voltage: 18V; Independent Circuits: 2; Propagation Delay: 190ns; Polarity: Inverting; Quiescent Current: 100uA; Logic Function: Demultiplexer,Decoder; Number of Pins: 16; Radiation Hardening: No; Supply Type: Dual; Package Quantity: 2500; Lead Free: Lead Free; Min Operating Temperature: -55°C; Number of Output Lines: 4; Number of Outputs: 4; Number of Channels: 2; Contact Plating: Gold; Max Operating Temperature: 125°C; Weight: 0.004998oz; Low Level Output Current: 6.8mA; Case/Package: SOIC; Packaging: Tape and Reel; Mount: Surface Mount; Number of Inputs: 2; Number of Elements: 2